# Altium schematic sheet 03_Sensor.SchDoc
size A4
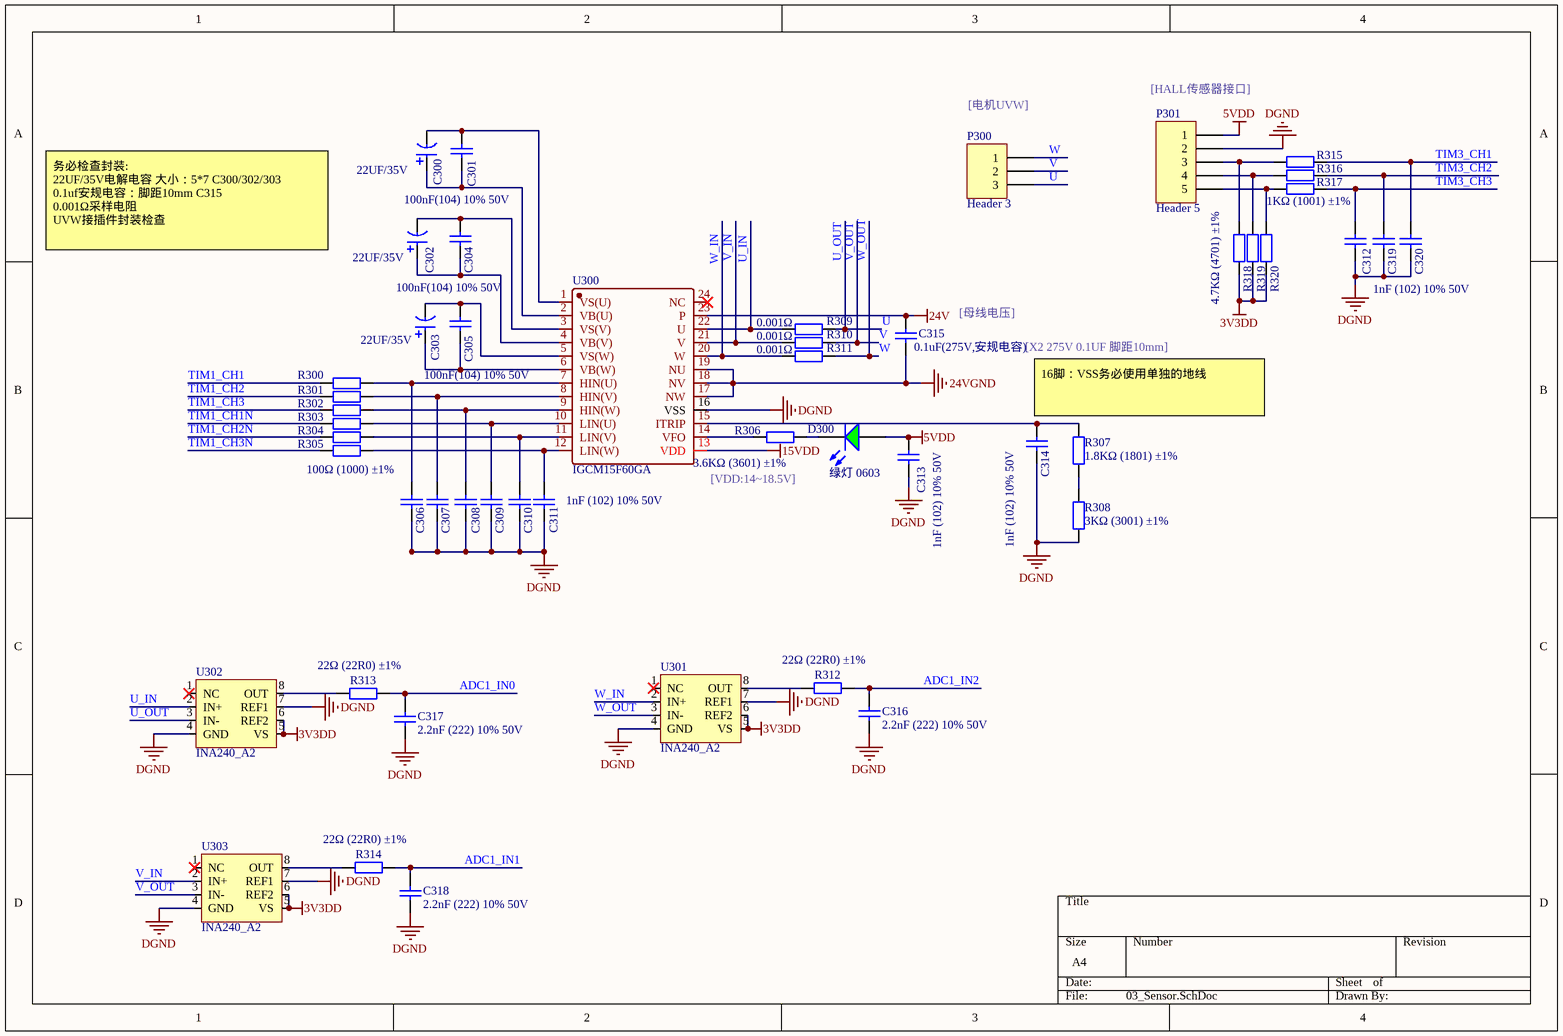
[diagram p0: 03_Sensor.SchDoc]

## Parts
C300  22UF/35V  [电解电容5*7]
C301  100nF(104) 10% 50V  [0805_C]
C302  22UF/35V  [电解电容5*7]
C303  22UF/35V  [电解电容5*7]
C304  100nF(104) 10% 50V  [0805_C]
C305  100nF(104) 10% 50V  [0805_C]
C306  1nF (102) 10% 50V  [0603_C]  (value not drawn)
C307  1nF (102) 10% 50V  [0603_C]  (value not drawn)
C308  1nF (102) 10% 50V  [0603_C]  (value not drawn)
C309  1nF (102) 10% 50V  [0603_C]  (value not drawn)
C310  1nF (102) 10% 50V  [0603_C]  (value not drawn)
C311  1nF (102) 10% 50V  [0603_C]
C312  1nF (102) 10% 50V  [0603_C]
C313  1nF (102) 10% 50V  [0603_C]
C314  1nF (102) 10% 50V  [0603_C]
C315  0.1uF(275V,安规电容)  [X2_安规电容_10MM]
C316  2.2nF (222) 10% 50V  [0603_C]
C317  2.2nF (222) 10% 50V  [0603_C]
C318  2.2nF (222) 10% 50V  [0603_C]
C319  1nF (102) 10% 50V  [0603_C]  (value not drawn)
C320  1nF (102) 10% 50V  [0603_C]  (value not drawn)
D300  绿灯 0603  [0603_LED_S1]
P300  Header 3  [KF2EDGK-3.81-WI-3P]
P301  Header 5  [KF2EDGK-3.81-WI-5P]
R300  100Ω (1000) ±1%  [0603_R]  (value not drawn)
R301  100Ω (1000) ±1%  [0603_R]  (value not drawn)
R302  100Ω (1000) ±1%  [0603_R]  (value not drawn)
R303  100Ω (1000) ±1%  [0603_R]  (value not drawn)
R304  100Ω (1000) ±1%  [0603_R]  (value not drawn)
R305  100Ω (1000) ±1%  [0603_R]
R306  3.6KΩ (3601) ±1%  [0603_R]
R307  1.8KΩ (1801) ±1%  [0603_R]
R308  3KΩ (3001) ±1%  [0603_R]
R309  0.001Ω  [R1206]
R310  0.001Ω  [R1206]
R311  0.001Ω  [R1206]
R312  22Ω (22R0) ±1%  [0603_R]
R313  22Ω (22R0) ±1%  [0603_R]
R314  22Ω (22R0) ±1%  [0603_R]
R315  1KΩ (1001) ±1%  [0603_R]  (value not drawn)
R316  1KΩ (1001) ±1%  [0603_R]  (value not drawn)
R317  1KΩ (1001) ±1%  [0603_R]
R318  4.7KΩ (4701) ±1%  [0603_R]  (value not drawn)
R319  4.7KΩ (4701) ±1%  [0603_R]  (value not drawn)
R320  4.7KΩ (4701) ±1%  [0603_R]
U300  IGCM15F60GA  [IGCM15F60GA]
U301  INA240_A2  [INA240A2PWR]
U302  INA240_A2  [INA240A2PWR]
U303  INA240_A2  [INA240A2PWR]

## Nets
3V3DD: R318.1 R319.1 R320.1 U301.5(VS) U301.6(REF2) U302.5(VS) U302.6(REF2) U303.5(VS) U303.6(REF2)
5VDD: C313.2 D300.A P301.1
15VDD: U300.13(VDD)
24V: C315.2 U300.23(P)
24VGND: C315.1 U300.17(NW) U300.18(NV) U300.19(NU)
DGND: C306.1 C307.1 C308.1 C309.1 C310.1 C311.1 C312.1 C313.1 C314.1 C316.1 C317.1 C318.1 C319.1 C320.1 P301.2 R308.1 U300.16(VSS) U301.4(GND) U301.7(REF1) U302.4(GND) U302.7(REF1) U303.4(GND) U303.7(REF1)
ADC1_IN0: C317.2 R313.2
ADC1_IN1: C318.2 R314.2
ADC1_IN2: C316.2 R312.2
TIM1_CH1: R300.1
TIM1_CH1N: R303.1
TIM1_CH2: R301.1
TIM1_CH2N: R304.1
TIM1_CH3: R302.1
TIM1_CH3N: R305.1
TIM3_CH1: C320.2 R315.2
TIM3_CH2: C319.2 R316.2
TIM3_CH3: C312.2 R317.2
U: P300.3 R309.2 U302.3(IN-)  [also labelled U_OUT]
U_IN: R309.1 U300.22(U) U302.2(IN+)
V: P300.2 R310.2 U303.3(IN-)  [also labelled V_OUT]
V_IN: R310.1 U300.21(V) U303.2(IN+)
W: P300.1 R311.2 U301.3(IN-)  [also labelled W_OUT]
W_IN: R311.1 U300.20(W) U301.2(IN+)
NetC300_1: C300.1 C301.1 U300.2(VB(U))
NetC300_2: C300.2 C301.2 U300.1(VS(U))
NetC302_1: C302.1 C304.1 U300.4(VB(V))
NetC302_2: C302.2 C304.2 U300.3(VS(V))
NetC303_1: C303.1 C305.1 U300.6(VB(W))
NetC303_2: C303.2 C305.2 U300.5(VS(W))
NetC306_2: C306.2 R300.2 U300.7(HIN(U))
NetC307_2: C307.2 R301.2 U300.8(HIN(V))
NetC308_2: C308.2 R302.2 U300.9(HIN(W))
NetC309_2: C309.2 R303.2 U300.10(LIN(U))
NetC310_2: C310.2 R304.2 U300.11(LIN(V))
NetC311_2: C311.2 R305.2 U300.12(LIN(W))
NetC314_2: C314.2 R307.2 U300.15(ITRIP)
NetD300_K: D300.K R306.2
NetP301_3: P301.3 R315.1 R318.2
NetP301_4: P301.4 R316.1 R319.2
NetP301_5: P301.5 R317.1 R320.2
NetR306_1: R306.1 U300.14(VFO)
NetR307_1: R307.1 R308.2
NetR312_1: R312.1 U301.8(OUT)
NetR313_1: R313.1 U302.8(OUT)
NetR314_1: R314.1 U303.8(OUT)

Not connected (* = marked no-connect by the designer): U300 24(NC)*; U301 1(NC)*; U302 1(NC)*; U303 1(NC)*

## Notes on the sheet
- (near P300) [电机UVW]
- (near P301) [HALL传感器接口]
- 务必检查封装:
  22UF/35V电解电容 大小：5*7 C300/302/303
  0.1uf安规电容：脚距10mm C315
  0.001Ω采样电阻
  UVW接插件封装检查
- (near C315) [母线电压]
- [X2 275V 0.1UF 脚距10mm]
- 16脚：VSS务必使用单独的地线
- [VDD:14~18.5V]

## Library data of the parts
C300 C302 C303 = CAP2: 电解电容
C301 C304 C305 = 0805 100nF(104) 10% 50V: 贴片电容; ComponentLink1Description: 供应商链接; ComponentLink1URL: http://www.szlcsc.com/product/details_50686.html; Package: 0805; Supplier: LC; SuppliersPartNumber: C49678
C306-C314 C319 C320 = 0603 1nF (102) 10% 50V: 贴片电容; ComponentLink1Description: 供应商链接; ComponentLink1URL: http://www.szlcsc.com/product/details_1940.html; Package: 0603; Supplier: LC; SuppliersPartNumber: C1588
C315 = 0603 100nF (104) 10% 50V: 贴片电容; ComponentLink1Description: 供应商链接; ComponentLink1URL: http://www.szlcsc.com/product/details_15331.html; Package: 0603; Supplier: LC; SuppliersPartNumber: C14663
C316-C318 = 0603 2.2nF (222) 10% 50V: 贴片电容; ComponentLink1Description: 供应商链接; ComponentLink1URL: http://www.szlcsc.com/product/details_1956.html; Package: 0603; Supplier: LC; SuppliersPartNumber: C1604
D300 = 0603 绿灯: 发光二极管; ComponentLink1Description: 供应商链接; ComponentLink1URL: http://www.szlcsc.com/product/details_73152.html; Package: 0603; Supplier: LC; SuppliersPartNumber: C72043
P300 = Header 3: Header, 3-Pin; LatestRevisionDate: 17-Jul-2002; LatestRevisionNote: Re-released for DXP Platform.; Publisher: Altium Limited
P301 = Header 5: Header, 5-Pin; LatestRevisionDate: 17-Jul-2002; LatestRevisionNote: Re-released for DXP Platform.; Publisher: Altium Limited
R300-R305 = 0603 100Ω (1000) 1%: 贴片电阻; ComponentLink1Description: 供应商链接; ComponentLink1URL: http://www.szlcsc.com/product/details_23502.html; Package: 0603; Supplier: LC; SuppliersPartNumber: C22775
R306 = 0603 3.6KΩ (3601) 1%: 贴片电阻; ComponentLink1Description: 供应商链接; ComponentLink1URL: http://www.szlcsc.com/product/details_23707.html; Package: 0603; Supplier: LC; SuppliersPartNumber: C22980
R307 = 0603 1.8KΩ (1801) 1%: 贴片电阻; ComponentLink1Description: 供应商链接; ComponentLink1URL: http://www.szlcsc.com/product/details_4584.html; Package: 0603; Supplier: LC; SuppliersPartNumber: C4177
R308 = 0603 3KΩ (3001) 1%: 贴片电阻; ComponentLink1Description: 供应商链接; ComponentLink1URL: http://www.szlcsc.com/product/details_4618.html; Package: 0603; Supplier: LC; SuppliersPartNumber: C4211
R309-R311 = 0805 10KΩ (1002) 1%: 贴片电阻; ComponentLink1Description: 供应商链接; ComponentLink1URL: http://www.szlcsc.com/product/details_18102.html; Package: 0805; Supplier: LC; SuppliersPartNumber: C17414
R312-R314 = 0603 22Ω (22R0) 1%: 贴片电阻; ComponentLink1Description: 供应商链接; ComponentLink1URL: http://www.szlcsc.com/product/details_24078.html; Package: 0603; Supplier: LC; SuppliersPartNumber: C23345
R315-R317 = 0603 1KΩ (1001) 1%: 贴片电阻; ComponentLink1Description: 供应商链接; ComponentLink1URL: http://www.szlcsc.com/product/details_21904.html; Package: 0603; Supplier: LC; SuppliersPartNumber: C21190
R318-R320 = 0603 4.7KΩ (4701) 1%: 贴片电阻; ComponentLink1Description: 供应商链接; ComponentLink1URL: http://www.szlcsc.com/product/details_23889.html; Package: 0603; Supplier: LC; SuppliersPartNumber: C23162